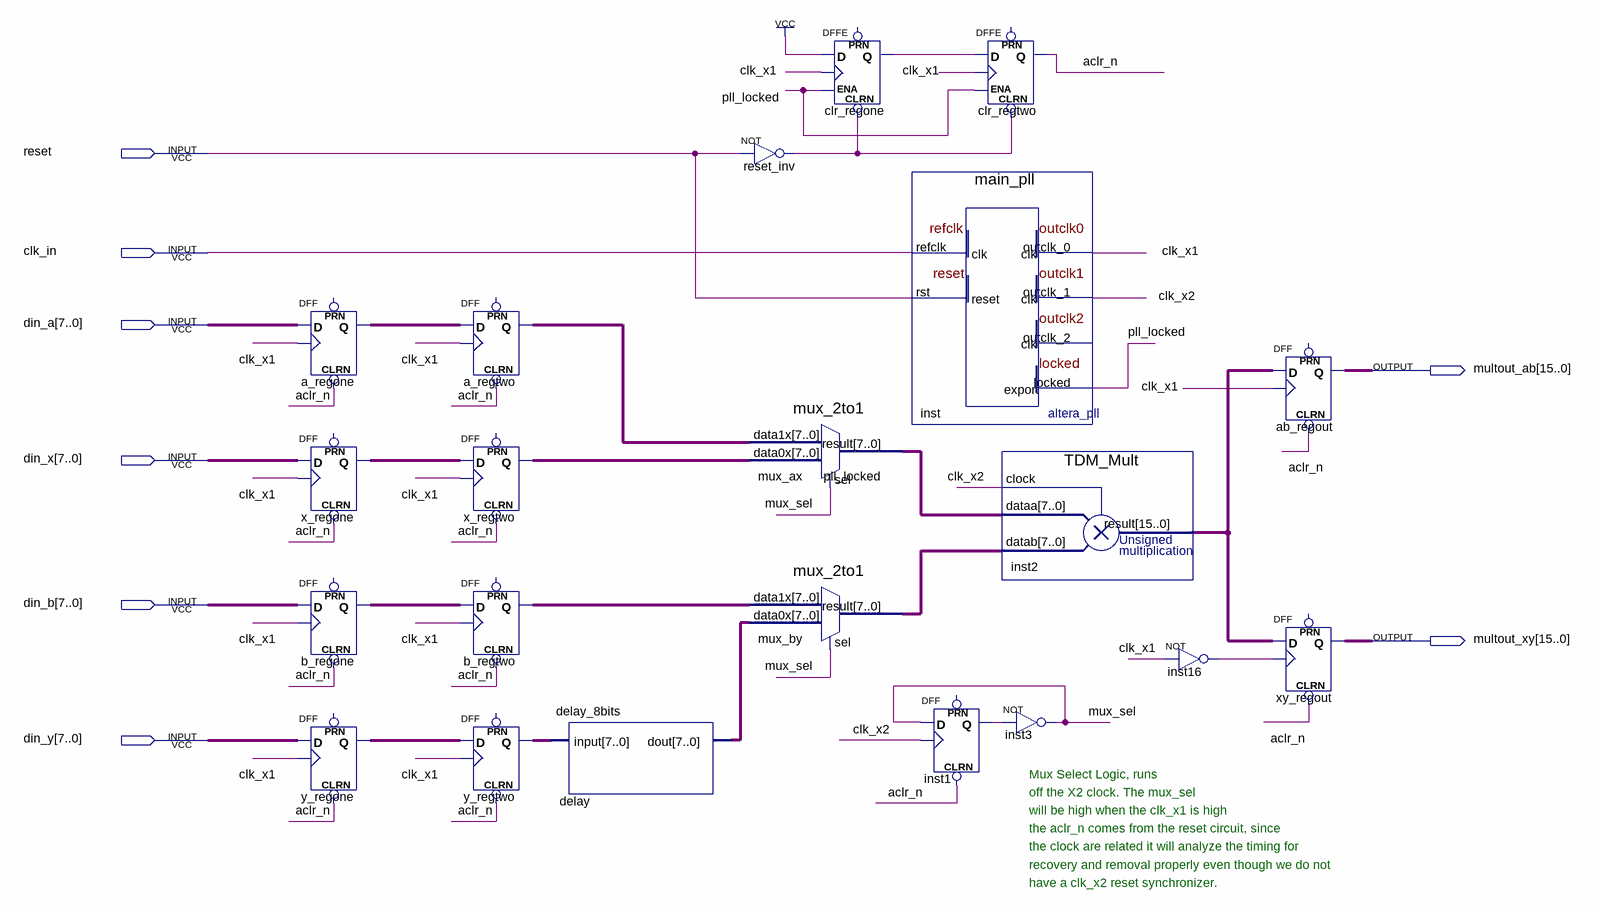
[diagram p0: schematic sheet]
// Quartus schematic top.bdf as structural Verilog: 21 symbols, 8 pins
module top (
  input  reset,
  input  clk_in,
  input  [7:0] din_a,
  input  [7:0] din_x,
  input  [7:0] din_b,
  input  [7:0] din_y,
  output [15:0] multout_ab,
  output [15:0] multout_xy
);

  wire aclr_n, clk_x1, clk_x2, clr_regone_q, inst1_q, inst16_out, mux_sel, pll_locked, reset_inv_out;
  wire [7:0] a_regone_q, a_regtwo_q, b_regone_q, b_regtwo_q, delay_dout, mux_ax_result, mux_by_result,
       x_regone_q, x_regtwo_q, y_regone_q, y_regtwo_q;
  wire [15:0] inst2_result;

  DFF a_regone[7:0] (.CLRN(aclr_n), .CLK(clk_x1), .D(din_a), .Q(a_regone_q));  // open: PRN
  DFF x_regone[7:0] (.CLRN(aclr_n), .CLK(clk_x1), .D(din_x), .Q(x_regone_q));  // open: PRN
  DFF b_regone[7:0] (.CLRN(aclr_n), .CLK(clk_x1), .D(din_b), .Q(b_regone_q));  // open: PRN
  DFF y_regone[7:0] (.CLRN(aclr_n), .CLK(clk_x1), .D(din_y), .Q(y_regone_q));  // open: PRN
  DFF a_regtwo[7:0] (.CLRN(aclr_n), .CLK(clk_x1), .D(a_regone_q), .Q(a_regtwo_q));  // open: PRN
  DFF x_regtwo[7:0] (.CLRN(aclr_n), .CLK(clk_x1), .D(x_regone_q), .Q(x_regtwo_q));  // open: PRN
  DFF b_regtwo[7:0] (.CLRN(aclr_n), .CLK(clk_x1), .D(b_regone_q), .Q(b_regtwo_q));  // open: PRN
  DFF y_regtwo[7:0] (.CLRN(aclr_n), .CLK(clk_x1), .D(y_regone_q), .Q(y_regtwo_q));  // open: PRN
  delay_8bits delay (.\input (y_regtwo_q), .dout(delay_dout));
  not reset_inv (reset_inv_out, reset);
  mux_2to1 mux_ax (.data1x(a_regtwo_q), .data0x(x_regtwo_q), .sel(mux_sel), .result(mux_ax_result));
  mux_2to1 mux_by (.data1x(b_regtwo_q), .data0x(delay_dout), .sel(mux_sel), .result(mux_by_result));
  DFFE clr_regone (.CLRN(reset_inv_out), .D(1'b1), .CLK(clk_x1), .ENA(pll_locked), .Q(clr_regone_q));  // open: PRN
  main_pll inst (
    .refclk(clk_in), .rst(reset), .outclk_0(clk_x1), .outclk_1(clk_x2), .locked(pll_locked));  // open: outclk_2
  DFF inst1 (.CLRN(aclr_n), .CLK(clk_x2), .D(mux_sel), .Q(inst1_q));  // open: PRN
  DFFE clr_regtwo (.CLRN(reset_inv_out), .D(clr_regone_q), .CLK(clk_x1), .ENA(pll_locked), .Q(aclr_n));  // open: PRN
  TDM_Mult inst2 (.clock(clk_x2), .dataa(mux_ax_result), .datab(mux_by_result), .result(inst2_result));
  not inst3 (mux_sel, inst1_q);
  not inst16 (inst16_out, clk_x1);
  DFF ab_regout[15:0] (.CLRN(aclr_n), .CLK(clk_x1), .D(inst2_result), .Q(multout_ab));  // open: PRN
  DFF xy_regout[15:0] (.CLRN(aclr_n), .CLK(inst16_out), .D(inst2_result), .Q(multout_xy));  // open: PRN

  // Notes on the sheet:
  //   Mux Select Logic, runs
  //   off the X2 clock. The mux_sel
  //   will be high when the clk_x1 is high
  //   the aclr_n comes from the reset circuit, since
  //   the clock are related it will analyze the timing for
  //   recovery and removal properly even though we do not
  //   have a clk_x2 reset synchronizer.
endmodule
